# Altium schematic sheet PWR_TLV62084.SchDoc
size A3; SheetNumber: 1; SheetTotal: 1
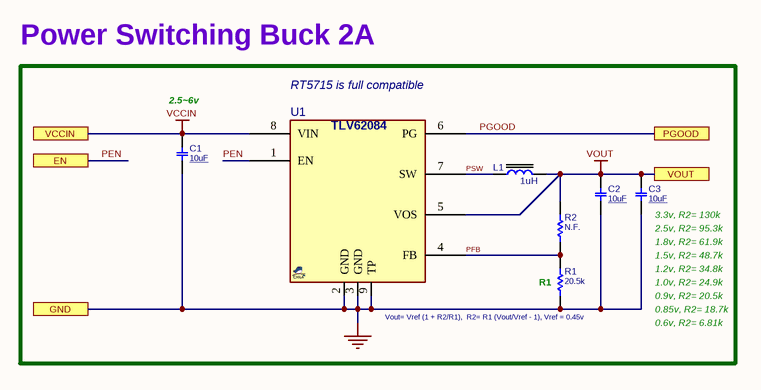
[diagram p0: PWR_TLV62084.SchDoc]

## Parts
C1  10uF  [C0402]
C2  10uF  [C0402]
C3  10uF  [C0402]
L1  1uH  [L0806]
R1  20.5k  [R0402]
R2  N.F.  [R0402]
U1  TLV62084  [SON50_8T_2020]  (value not drawn)

## Ports
EN, GND, PGOOD, VCCIN, VOUT

## Nets
GND: C1.2 C2.2 C3.2 R1.1 U1.2(GND) U1.3(GND) U1.9(TP) ; port GND
VCCIN: C1.1 U1.8(VIN) ; port VCCIN
VOUT: C2.1 C3.1 L1.2 R2.2 U1.5(VOS) ; port VOUT
PEN: U1.1(EN) ; port EN
PFB: R1.2 R2.1 U1.4(FB)
PGOOD: U1.6(PG) ; port PGOOD
PSW: L1.1 U1.7(SW)

## Notes on the sheet
- Power Switching Buck 2A
- (near C1) 2.5~6v
- (near U1) RT5715 is full compatible
- (near C3) 3.3v, R2= 130k
- (near C3) 2.5v, R2= 95.3k
- (near R1) R1
- 1.2v, R2= 34.8k
- (near C3) 1.8v, R2= 61.9k
- 1.5v, R2= 48.7k
- 1.0v, R2= 24.9k
- 0.9v, R2= 20.5k
- Vout= Vref (1 + R2/R1),  R2= R1 (Vout/Vref - 1), Vref = 0.45v
- 0.85v, R2= 18.7k
- 0.6v, R2= 6.81k

## Library data of the parts
C1-C3 = CAP_SMD_MLCC: CAP, MLCC; PARAM: X5R, 20%; PARAM2: 10v; PRICE: 100= 1$; DESC: CAP, MLCC; MANF_P#: -; MANF: -; ASSEMBLY: ASSEMBLY; VALUE: 10uF
L1 = INDPWR_SMD: INDUCTOR, POWER, SMD; MANF: Murata; MANF_P#: DFE201610E-1R0M; PARAM: 2.7A, 57mDCR; PRICE: 0.1$; VALUE: 1uH
R1 R2 = RES_SMD: RESISTOR, SMD; PARAM: -W; DESC: DESCRIPTION; DIST#: MOUSER; PARAM2: 1%; MANF_P#: -; MANF: -; ASSEMBLY: ASSEMBLY; PRICE: 100= 0.5$
  R1: VALUE: 20.5k
  R2: VALUE: N.F.
U1 = VREG_TLV62084_SON8: REG, Switching, Buck, 2A, ADJ, 2MHz, 2.5~6VIN, SON-8; MANF_P#: TLV62084DSG; MANF: Texas Instruments; PARAM: 2A, ADJ, -40~85oC; PARAM2: 2MHz, 2.5~6VIN, 90% Eff; ASSEMBLY: ASSEMBLY; PRICE: 0.3$; VALUE: TLV62084; PACKAGE: WSON-8